# EAGLE design Butia Eagle v6 (EAGLE 5.09)
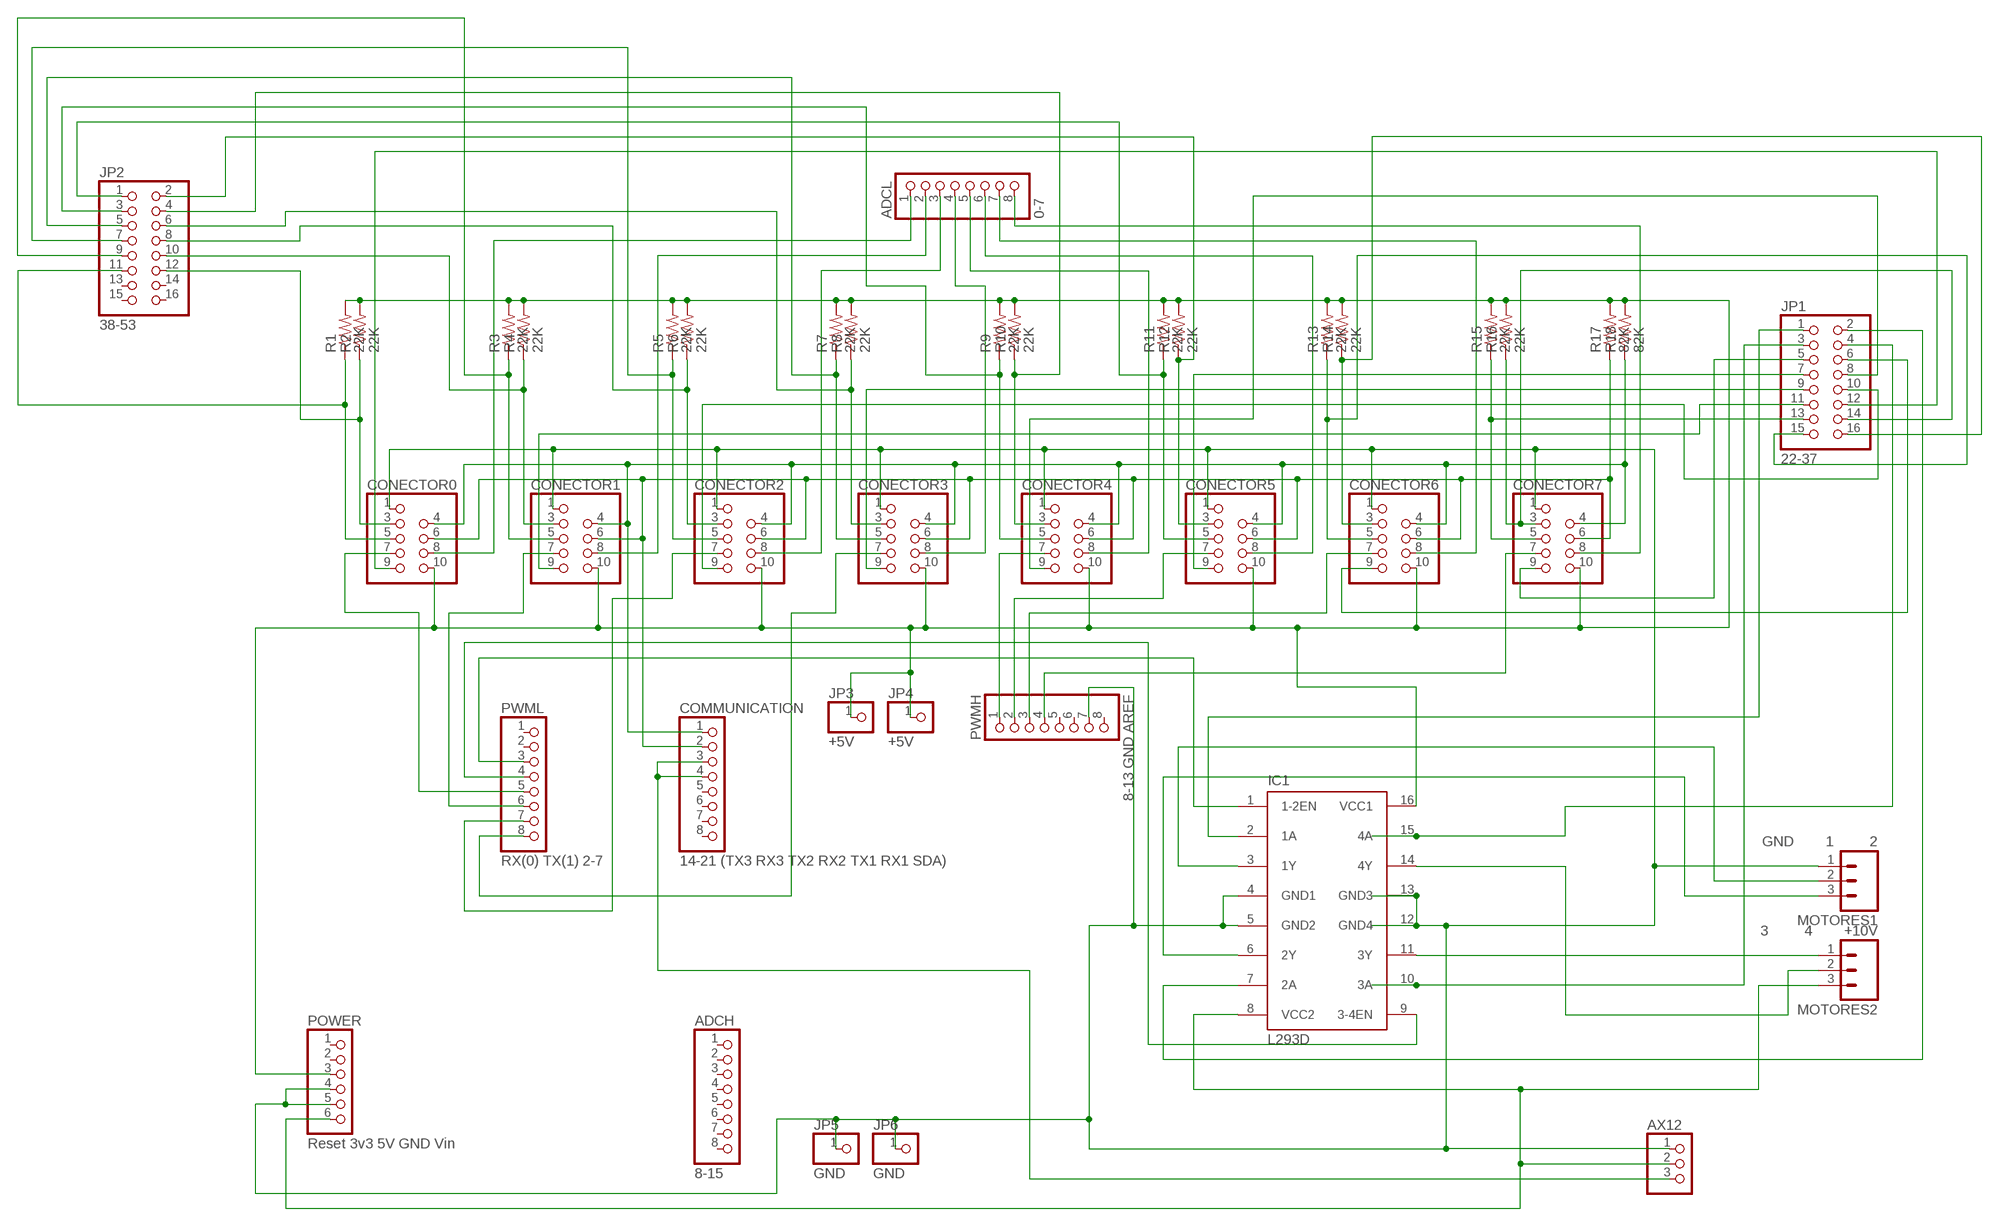
[diagram p0: schematic, sheet 1]

## Parts
ADCH  8-15  PINHD-1X8  [1X08]
ADCL  0-7  PINHD-1X8  [1X08]
AX12  AX12  [AX12]
COMMUNICATION  14-21 (TX3 RX3 TX2 RX2 TX1 RX1 SDA)  PINHD-1X8  [1X08]
CONECTOR0  9PIN  [9PIN]
CONECTOR1  9PIN  [9PIN]
CONECTOR2  9PIN  [9PIN]
CONECTOR3  9PIN  [9PIN]
CONECTOR4  9PIN  [9PIN]
CONECTOR5  9PIN  [9PIN]
CONECTOR6  9PIN  [9PIN]
CONECTOR7  9PIN  [9PIN]
IC1  L293D  [DIL16]
JP1  22-37  PINHD-2X8  [2X08]
JP2  38-53  PINHD-2X8  [2X08]
JP3  +5V  PINHD-1X1  [1X01]
JP4  +5V  PINHD-1X1  [1X01]
JP5  GND  PINHD-1X1  [1X01]
JP6  GND  PINHD-1X1  [1X01]
MOTORES1  GND 1 2  M03SCREW_LOCK  [SCREWTERMINAL-3.5MM-3_LOCK.007S]
MOTORES2  3 4 +10V  M03SCREW_LOCK  [SCREWTERMINAL-3.5MM-3_LOCK.007S]
POWER  Reset 3v3 5V GND Vin  PINHD-1X6  [1X06]
PWMH  8-13 GND AREF  PINHD-1X8  [1X08]
PWML  RX(0) TX(1) 2-7  PINHD-1X8  [1X08]
R1  22K  R-US_0207/7  [0207/7]
R2  22K  R-US_0207/7  [0207/7]
R3  22K  R-US_0207/7  [0207/7]
R4  22K  R-US_0207/7  [0207/7]
R5  22K  R-US_0207/7  [0207/7]
R6  22K  R-US_0207/7  [0207/7]
R7  22K  R-US_0207/7  [0207/7]
R8  22K  R-US_0207/7  [0207/7]
R9  22K  R-US_0207/7  [0207/7]
R10  22K  R-US_0207/7  [0207/7]
R11  22K  R-US_0207/7  [0207/7]
R12  22K  R-US_0207/7  [0207/7]
R13  22K  R-US_0207/7  [0207/7]
R14  22K  R-US_0207/7  [0207/7]
R15  22K  R-US_0207/7  [0207/7]
R16  22K  R-US_0207/7  [0207/7]
R17  82K  R-US_0207/7  [0207/7]
R18  82K  R-US_0207/7  [0207/7]

## Nets
+10V [power]: AX12.2 IC1.8(VCC2) MOTORES2.3 POWER.6
MASA [gnd]: AX12.1 CONECTOR0.1 CONECTOR1.1 CONECTOR2.1 CONECTOR3.1 CONECTOR4.1 CONECTOR5.1 CONECTOR6.1 CONECTOR7.1 IC1.4(GND1) IC1.5(GND2) IC1.12(GND4) IC1.13(GND3) JP5.1 JP6.1 MOTORES1.1 POWER.4 POWER.5 PWMH.7
N$1: CONECTOR0.5 JP2.11 R1.1
N$2: CONECTOR0.3 JP2.12 R2.1
N$3: CONECTOR1.5 JP2.9 R3.1
N$4: CONECTOR1.3 JP2.10 R4.1
N$5: CONECTOR2.5 JP2.7 R5.1
N$6: CONECTOR2.3 JP2.8 R6.1
N$8: CONECTOR3.5 JP2.5 R7.1
N$9: CONECTOR3.3 JP2.6 R8.1
N$10: CONECTOR4.3 JP2.4 R10.1
N$11: CONECTOR4.5 JP2.3 R9.1
N$13: CONECTOR5.3 JP2.2 R12.1
N$15: CONECTOR6.3 JP1.16 R14.1
N$16: CONECTOR7.5 JP1.13 R15.1
N$17: CONECTOR7.3 JP1.14 R16.1
N$18: ADCL.1 CONECTOR0.8
N$19 [polenta]: IC1.14(4Y) MOTORES2.2
N$20 [polenta]: IC1.11(3Y) MOTORES2.1
N$21 [polenta]: IC1.6(2Y) MOTORES1.3
N$22 [polenta]: IC1.3(1Y) MOTORES1.2
N$23: ADCL.2 CONECTOR1.8
N$24: ADCL.3 CONECTOR2.8
N$25: ADCL.4 CONECTOR3.8
N$26: ADCL.5 CONECTOR4.8
N$27: ADCL.6 CONECTOR5.8
N$28: ADCL.7 CONECTOR6.8
N$29: ADCL.8 CONECTOR7.8
N$30: AX12.3 COMMUNICATION.3 COMMUNICATION.4
N$31: IC1.1(1-2EN) PWML.3
N$32: IC1.9(3-4EN) PWML.4
N$33: CONECTOR0.7 PWML.5
N$34: CONECTOR1.7 PWML.6
N$35: CONECTOR2.7 PWML.7
N$36: CONECTOR3.7 PWML.8
N$37: CONECTOR4.7 PWMH.1
N$38: CONECTOR5.7 PWMH.2
N$39: CONECTOR6.7 PWMH.3
N$40: CONECTOR7.7 PWMH.4
N$41: IC1.2(1A) JP1.1
N$42: IC1.7(2A) JP1.2
N$43: IC1.10(3A) JP1.3
N$44: IC1.15(4A) JP1.4
N$45: CONECTOR7.9 JP1.5
N$46: CONECTOR6.9 JP1.6
N$47: CONECTOR5.9 JP1.7
N$48: CONECTOR4.9 JP1.8
N$49: CONECTOR3.9 JP1.9
N$50: CONECTOR2.9 JP1.10
N$51: CONECTOR1.9 JP1.11
N$52: CONECTOR0.9 JP1.12
N$53: CONECTOR5.5 JP2.1 R11.1
N$54: CONECTOR6.5 JP1.15 R13.1
POSITIVO [power]: CONECTOR0.10 CONECTOR1.10 CONECTOR2.10 CONECTOR3.10 CONECTOR4.10 CONECTOR5.10 CONECTOR6.10 CONECTOR7.10 IC1.16(VCC1) JP3.1 JP4.1 POWER.3 R1.2 R2.2 R3.2 R4.2 R5.2 R6.2 R7.2 R8.2 R9.2 R10.2 R11.2 R12.2 R13.2 R14.2 R15.2 R16.2 R17.2 R18.2
SCL: COMMUNICATION.1 CONECTOR0.4 CONECTOR1.4 CONECTOR2.4 CONECTOR3.4 CONECTOR4.4 CONECTOR5.4 CONECTOR6.4 CONECTOR7.4 R18.1
SDA: COMMUNICATION.2 CONECTOR0.6 CONECTOR1.6 CONECTOR2.6 CONECTOR3.6 CONECTOR4.6 CONECTOR5.6 CONECTOR6.6 CONECTOR7.6 R17.1
Unconnected: ADCH.1 ADCH.2 ADCH.3 ADCH.4 ADCH.5 ADCH.6 ADCH.7 ADCH.8 COMMUNICATION.5 COMMUNICATION.6 COMMUNICATION.7 COMMUNICATION.8 JP2.13 JP2.14 JP2.15 JP2.16 POWER.1 POWER.2 PWMH.5 PWMH.6 PWMH.8 PWML.1 PWML.2

## Library data of the parts
ADCH ADCL COMMUNICATION PWMH PWML = pinhead:PINHD-1X8: PIN HEADER
AX12 = butia:AX12
CONECTOR0 CONECTOR1-CONECTOR7 = butia:9PIN
IC1 = st-microelectronics:L293D: PUSH-PULL 4 CHANNEL DRIVER
JP1 JP2 = pinhead:PINHD-2X8: PIN HEADER
JP3-JP6 = pinhead:PINHD-1X1: PIN HEADER
MOTORES1 MOTORES2 = SparkFun:M03: Header 3 Standard 3-pin 0.1" header. Use with straight break away headers (SKU : PRT-00116), right angle break away headers (PRT-00553), swiss pins (PRT-00743), machine pins (PRT-00117), and female headers (PRT-00115). Molex polarized connector foot print use with SKU : PRT-08232 with associated crimp pins and housings.
POWER = pinhead:PINHD-1X6: PIN HEADER
R1-R18 = resistor:R-US_: RESISTOR, American symbol

## Net classes
0 default: width 0.229 mm, drill 0.406 mm, clearance 0.203 mm
1 power: width 0.508 mm, drill 0.711 mm, clearance 0.203 mm
2 gnd: width 0.406 mm, drill 0.61 mm, clearance 0.203 mm
3 polenta: width 0.356 mm, drill 0.508 mm, clearance 0.203 mm

## Board
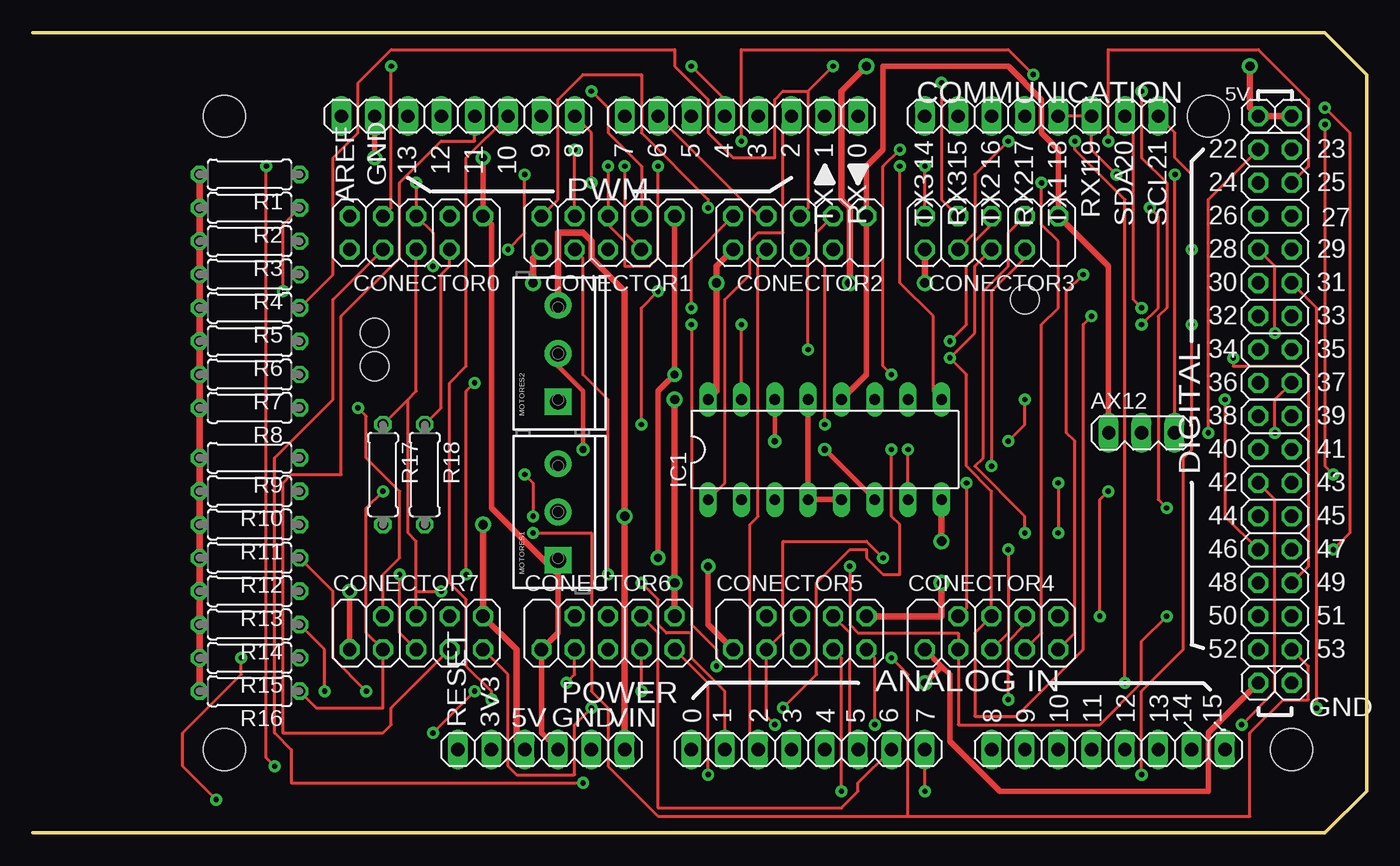
[diagram p1: board, top side]
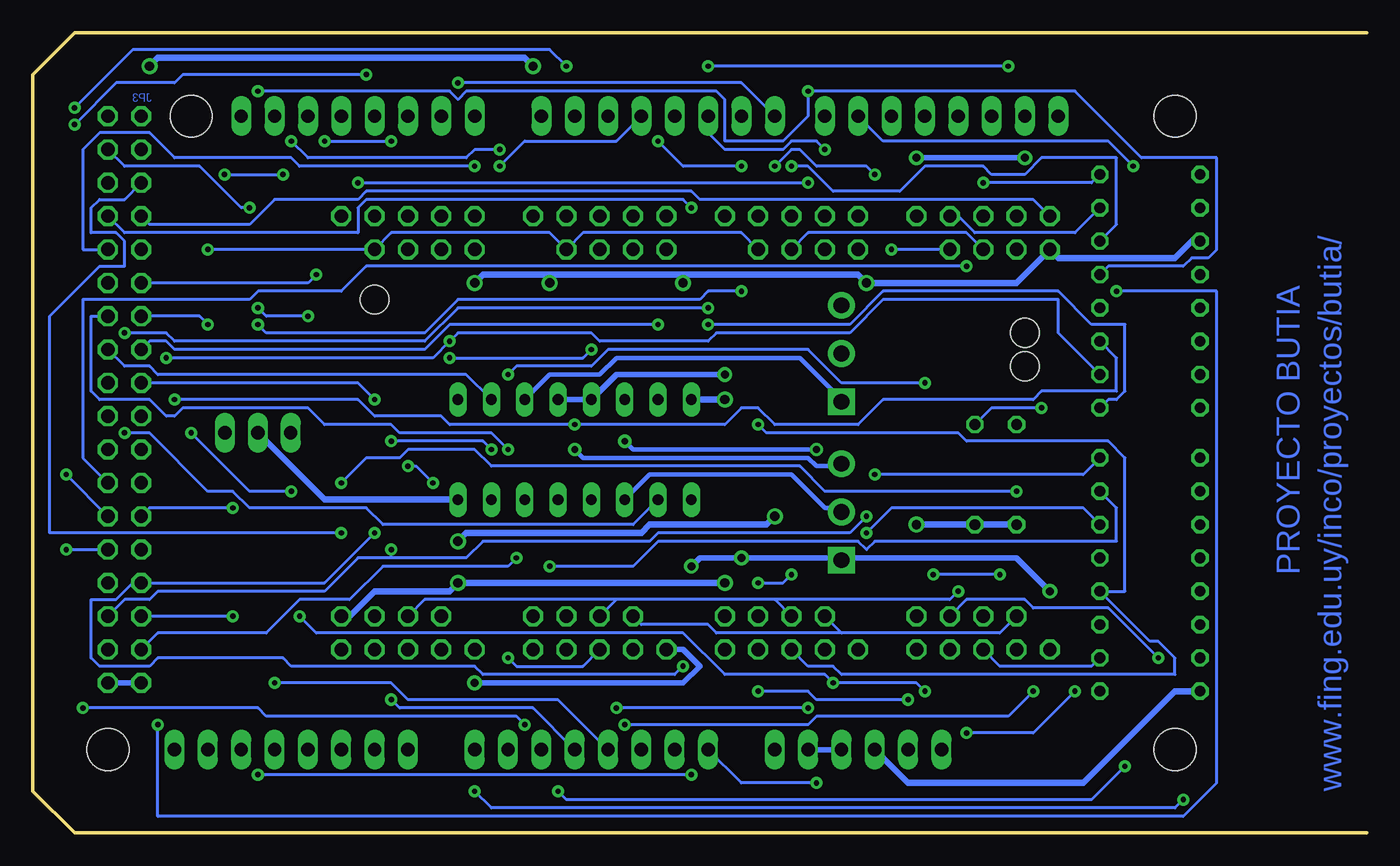
[diagram p2: board, bottom side, seen from below]

Size 101.6 x 60.96 mm. Coordinates in mm from the lower left corner, seen from the top.
Outline: 0,60.96 98.42,60.96 101.6,57.79 101.6,3.17 98.42,0 0,0
Copper layers (1*16): Top 0.035mm / dielectric 1.5mm / Bottom 0.035mm
Design rules "default *": minimum track width 8mil, minimum drill 16mil, track to track 8mil, track to pad 8mil, pad to pad 8mil, via to via 10mil, smd to smd 8mil, copper to edge 40mil, drill to drill 12mil, minimum pad ring 10mil, minimum via ring 10mil, stop-mask expansion 4mil, vias tented up to drill 0mil, thermal gap 10mil
Holes 3.2 mm at 95.88,6.35 14.61,54.61 89.53,54.61 14.61,6.35
Holes 2.2 mm at 75.56,40.64 26.04,38.1 26.04,35.56

### Footprints (pad centres in the part's own frame; a part is rotated, then mirrored left to right if it is on the bottom)
1X08 = drill 1.016 long: 1 -8.89,0; 2 -6.35,0; 3 -3.81,0; 4 -1.27,0; 5 1.27,0; 6 3.81,0; 7 6.35,0; 8 8.89,0
AX12 = drill 1.016 long: 1 -2.498,0; 2 0,0; 3 2.507,0.005
9PIN = drill 1.016 octagon: 1 -5.08,-1.27; 3 -2.54,-1.27; 4 -2.54,1.27; 5 0,-1.27; 6 0,1.27; 7 2.54,-1.27; 8 2.54,1.27; 9 5.08,-1.27; 10 5.08,1.27
DIL16 = drill 0.813 long: 1 -8.89,-3.81; 2 -6.35,-3.81; 3 -3.81,-3.81; 4 -1.27,-3.81; 5 1.27,-3.81; 6 3.81,-3.81; 7 6.35,-3.81; 8 8.89,-3.81; 9 8.89,3.81; 10 6.35,3.81; 11 3.81,3.81; 12 1.27,3.81; 13 -1.27,3.81; 14 -3.81,3.81; 15 -6.35,3.81; 16 -8.89,3.81
2X08 = drill 1.016 octagon: 1 -8.89,-1.27; 2 -8.89,1.27; 3 -6.35,-1.27; 4 -6.35,1.27; 5 -3.81,-1.27; 6 -3.81,1.27; 7 -1.27,-1.27; 8 -1.27,1.27; 9 1.27,-1.27; 10 1.27,1.27; 11 3.81,-1.27; 12 3.81,1.27; 13 6.35,-1.27; 14 6.35,1.27; 15 8.89,-1.27; 16 8.89,1.27
1X01 = drill 1.016 octagon: 1 0,0
SCREWTERMINAL-3.5MM-3_LOCK.007S = drill 1.2 pad 2.032 square: 1 -0.178,0 | drill 1.2 pad 2.032 round: 2 3.5,0; 3 7.178,0
1X06 = drill 1.016 long: 1 -6.35,0; 2 -3.81,0; 3 -1.27,0; 4 1.27,0; 5 3.81,0; 6 6.35,0
0207/7 = drill 0.813 octagon: 1 -3.81,0; 2 3.81,0

### Placement (x,y rotation side)
ADCH  81.91,6.35 0 top
ADCL  59.05,6.35 0 top
AX12  84.45,30.48 0 top
COMMUNICATION  76.83,54.61 180 top
CONECTOR0  29.21,45.72 180 top
CONECTOR1  43.82,45.72 180 top
CONECTOR2  58.42,45.72 180 top
CONECTOR3  73.02,45.72 180 top
CONECTOR4  73.02,15.24 0 top
CONECTOR5  58.42,15.24 0 top
CONECTOR6  43.82,15.24 0 top
CONECTOR7  29.21,15.24 0 top
IC1  60.33,29.21 0 top
JP1  94.61,43.18 90 top
JP2  94.61,22.86 90 top
JP3  93.34,54.61 0 top
JP4  95.88,54.61 0 top
JP5  93.34,11.43 0 top
JP6  95.88,11.43 0 top
MOTORES1  40.01,20.95 90 top
MOTORES2  40.01,33.02 90 top
POWER  38.73,6.35 0 top
PWMH  32.39,54.61 180 top
PWML  53.98,54.61 180 top
R1  16.51,50.16 180 top
R2  16.51,47.62 180 top
R3  16.51,45.09 180 top
R4  16.51,42.55 180 top
R5  16.51,40.01 180 top
R6  16.51,37.47 180 top
R7  16.51,34.92 180 top
R8  16.51,32.38 180 top
R9  16.51,28.57 180 top
R10  16.51,26.04 180 top
R11  16.51,23.49 180 top
R12  16.51,20.95 180 top
R13  16.51,18.41 180 top
R14  16.51,15.88 180 top
R15  16.51,13.34 180 top
R16  16.51,10.79 180 top
R17  26.67,27.3 270 top
R18  29.84,27.3 270 top

### Tracks (layer width: path | path; a pad name or v marks a point on that pad's centre or on a via)
+10V  (via drill 0.71)
  Top 0.508: POWER.6 v45.09,24.13 45.09,41.28 42.55,43.82 42.55,45.09 41.91,45.72 40.01,45.72 MOTORES2.3 | v69.21,22.22 IC1.8
  Bottom 0.508: IC1.8 79.38,25.4 AX12.2 | v69.21,22.22 68.58,22.86 55.25,22.86 54.61,23.49 45.72,23.49 v45.09,24.13
MASA  (via drill 0.61)
  Top 0.406: AX12.1 81.91,30.48 81.91,43.18 CONECTOR3.1 78.1,52.07 76.83,53.34 76.83,55.88 74.3,58.42 64.77,58.42 64.77,52.07 63.5,50.8 CONECTOR2.1 63.5,34.92 IC1.12 | IC1.5 IC1.4 IC1.13 | CONECTOR1.1 v48.9,34.92 47.62,33.66 v47.62,20.95 | 69.21,12.7 69.85,12.07 69.85,6.98 73.66,3.17 89.53,3.17 89.53,7.62 JP5.1 | 69.21,12.7 CONECTOR4.1 | CONECTOR7.1 v24.13,18.41 | 40.01,19.68 40.01,15.24 CONECTOR6.1 38.73,7.62 POWER.4 | MOTORES1.1 40.01,19.68 | 40.01,19.68 34.93,24.76 34.93,46.36 CONECTOR0.1 v34.29,51.44 | v26.04,51.44 PWMH.7 | CONECTOR5.1 51.44,15.88 v51.44,20.32 | v67.94,11.43 69.21,12.7
  Bottom 0.406: IC1.12 IC1.13 57.15,34.92 v48.9,34.92 | JP5.1 JP6.1 | POWER.4 POWER.5 | v24.13,18.41 26.67,20.95 40.01,20.95 | v34.29,51.44 v26.04,51.44 | v51.44,20.32 50.8,20.95 v47.62,20.95 40.01,20.95 | 40.01,20.95 MOTORES1.1 | v67.94,11.43 52.07,11.43 50.8,12.7 52.07,13.97 CONECTOR5.1
N$1  (via drill 0.41)
  Top 0.229: v29.21,49.53 CONECTOR0.5 30.48,45.72 v30.48,43.18
  Bottom 0.229: R1.1 20.95,49.53 v29.21,49.53 | JP2.11 97.79,28.57 97.79,40.64 85.09,40.64 84.45,41.28 78.1,41.28 76.2,43.18 v30.48,43.18
N$2  (via drill 0.41)
  Top 0.229: JP2.12 94.61,25.4 94.61,10.79 v92.07,8.26 | v19.05,41.28 19.05,46.36 R2.1
  Bottom 0.229: R2.1 22.22,45.72 29.84,45.72 31.11,46.99 CONECTOR0.3 | v92.07,8.26 92.07,1.27 13.97,1.27 11.43,3.81 11.43,41.28 v19.05,41.28
N$3  (via drill 0.41)
  Top 0.229: v43.82,50.8 CONECTOR1.5 43.82,46.36 45.09,45.09 45.09,43.18 46.99,43.18 47.62,43.82 v47.62,50.8 | v99.06,27.3 98.42,27.94 v98.42,53.98 | v76.2,57.79 74.3,59.69 53.98,59.69 v53.98,52.71
  Bottom 0.229: R3.1 19.05,46.36 19.05,51.44 24.76,51.44 26.04,50.16 28.57,50.16 29.21,50.8 33.66,50.8 35.56,48.9 40.64,48.9 42.55,50.8 v43.82,50.8 | v99.06,27.3 JP2.9 | v98.42,53.98 95.25,57.15 90.8,57.15 90.17,57.79 v76.2,57.79 | v53.98,52.71 52.07,50.8 v47.62,50.8
N$4  (via drill 0.41)
  Top 0.229: v42.55,56.52 43.82,55.25 43.82,53.34 46.36,50.8 CONECTOR1.3 | v86.36,24.76 85.72,25.4 85.72,39.37 86.36,40.01 86.36,49.53 84.45,51.44 v84.45,56.52
  Bottom 0.229: R4.1 19.68,43.18 13.97,43.18 13.34,43.82 12.06,43.82 11.43,44.45 11.43,51.44 17.14,51.44 22.22,56.52 v42.55,56.52 42.55,54.61 44.45,52.71 48.9,52.71 48.9,55.88 49.53,56.52 68.58,56.52 69.21,55.88 69.85,56.52 v84.45,56.52 | JP2.10 92.71,24.76 v86.36,24.76
N$5  (via drill 0.41)
  Top 0.229: R5.1 22.86,42.55 22.86,51.44 24.76,53.34 24.76,57.15 27.3,59.69 48.9,59.69 48.9,58.42 51.44,55.88 51.44,53.34 53.34,51.44 56.52,51.44 56.52,55.88 57.15,56.52 59.05,56.52 | 59.05,56.52 59.05,47.62 CONECTOR2.5 | v99.06,21.59 100.33,22.86 100.33,53.34 v98.42,55.25 | 59.05,56.52 v60.96,58.42
  Bottom 0.229: v99.06,21.59 JP2.7 | v98.42,55.25 93.98,59.69 62.23,59.69 v60.96,58.42
N$6  (via drill 0.41)
  Top 0.229: v60.33,31.11 60.33,43.18 59.69,43.82 59.69,45.72 CONECTOR2.3 | JP2.8 90.8,24.13 v90.8,33.02
  Bottom 0.229: R6.1 19.05,36.2 19.05,33.66 24.76,33.66 25.4,33.02 36.83,33.02 38.73,31.11 45.09,31.11 46.36,32.38 47.62,32.38 48.9,31.11 v60.33,31.11 69.85,31.11 70.48,31.75 75.56,31.75 76.83,33.02 v90.8,33.02
N$8  (via drill 0.41)
  Top 0.229: v69.85,37.47 71.12,38.73 71.12,43.18 71.75,43.82 71.75,45.09 73.02,46.36 CONECTOR3.5 | JP2.5 97.16,20.32 97.16,34.92 96.52,35.56 91.44,35.56 v91.44,36.2
  Bottom 0.229: R7.1 23.49,38.1 23.49,40.64 36.83,40.64 39.37,38.1 49.53,38.1 50.16,37.47 58.42,37.47 59.05,38.1 69.21,38.1 v69.85,37.47 71.12,36.2 v91.44,36.2
N$9  (via drill 0.41)
  Top 0.229: v50.16,38.73 50.16,15.88 52.07,13.97 v52.07,12.7 | CONECTOR3.3 74.3,45.72 74.3,43.18 72.39,41.28 72.39,28.57 71.75,27.94 75.56,24.13 v75.56,22.86
  Bottom 0.229: R8.1 19.68,33.02 19.05,33.02 18.41,33.66 18.41,38.73 20.95,38.73 23.49,41.28 36.83,41.28 39.37,38.73 v50.16,38.73 | v52.07,12.7 52.71,12.07 67.31,12.07 67.94,12.7 81.91,12.7 82.55,13.34 92.07,13.34 92.71,12.7 96.52,12.7 97.16,13.34 97.16,17.78 95.25,17.78 93.98,19.05 JP2.6 79.38,19.05 v75.56,22.86
N$10  (via drill 0.41)
  Top 0.229: v62.23,20.32 62.23,15.88 62.87,15.24 70.48,15.24 CONECTOR4.3 70.48,8.26 81.28,8.26 84.45,11.43 84.45,14.61 v86.36,16.51
  Bottom 0.229: R10.1 19.05,24.76 19.05,22.22 37.47,22.22 38.1,21.59 38.73,22.22 53.98,22.22 55.88,20.32 v62.23,20.32 | v86.36,16.51 JP2.4
N$11  (via drill 0.41)
  Top 0.229: v37.47,27.3 38.1,26.67 v38.1,24.13 | CONECTOR4.5 74.3,15.24 v74.3,21.59
  Bottom 0.229: R9.1 21.59,27.3 v37.47,27.3 | v38.1,24.13 39.37,22.86 53.98,22.86 54.61,22.22 67.31,22.22 68.58,20.95 74.3,20.95 | 74.3,20.95 76.83,20.95 79.38,18.41 92.07,18.41 92.71,17.78 94.61,17.78 JP2.3 | 74.3,20.95 v74.3,21.59
N$13  (via drill 0.41)
  Top 0.229: R12.1 22.86,18.41 22.86,13.34 v25.4,10.79 | v56.52,8.26 55.88,8.89 CONECTOR5.3 57.15,15.24 57.15,22.22 63.5,22.22 v64.77,20.95
  Bottom 0.229: v25.4,10.79 27.3,8.89 41.91,8.89 42.55,8.26 v56.52,8.26 | JP2.2 92.07,15.24 83.82,15.24 81.28,17.78 77.47,17.78 74.93,20.32 65.41,20.32 v64.77,20.95
N$15  (via drill 0.41)
  Top 0.229: R14.1 22.22,13.97 v22.22,10.79 | v30.48,7.62 v33.66,10.79 | v40.64,11.43 41.27,12.07 CONECTOR6.3 | JP1.16 89.53,48.26 v89.53,30.48 | v81.91,26.04 81.28,25.4 v81.28,16.51
  Bottom 0.229: v22.22,10.79 25.4,7.62 v30.48,7.62 | v33.66,10.79 34.29,11.43 v40.64,11.43 41.27,12.07 48.9,12.07 52.07,15.24 80.01,15.24 v81.28,16.51 | v89.53,30.48 85.09,26.04 v81.91,26.04
N$16  (via drill 0.41)
  Top 0.229: JP1.13 97.16,50.8 97.16,55.88 93.34,59.69 81.91,59.69 v81.91,52.71 | v66.04,52.07 64.77,50.8 64.77,35.56 v65.41,34.92 | v33.66,34.29 33.02,33.66 v33.02,19.68 | v27.94,19.68 27.94,15.24 CONECTOR7.5
  Bottom 0.229: R15.1 20.95,12.7 27.94,12.7 CONECTOR7.5 | v81.91,52.71 80.64,51.44 68.58,51.44 67.94,52.07 v66.04,52.07 | v65.41,34.92 64.77,35.56 59.05,35.56 57.79,36.83 42.55,36.83 40.01,34.29 v33.66,34.29 | v27.94,19.68 v33.02,19.68
N$17  (via drill 0.41)
  Top 0.229: R16.1 21.59,9.53 26.67,9.53 CONECTOR7.3 25.4,15.24 25.4,24.76 v26.67,26.04 | v78.1,26.67 v78.1,22.86
  Bottom 0.229: JP1.14 94.61,48.26 96.52,48.26 97.16,47.62 97.16,45.72 95.25,45.72 94.61,45.09 94.61,43.18 96.52,43.18 100.33,39.37 100.33,22.86 v78.1,22.86 | v78.1,26.67 76.2,28.57 73.66,28.57 73.02,29.21 67.94,29.21 66.67,27.94 43.18,27.94 41.27,26.04 v26.67,26.04
N$18  (via drill 0.41)
  Top 0.229: v41.91,3.81 19.68,3.81 19.68,6.35 18.41,7.62 18.41,28.57 22.86,33.02 22.86,40.64 CONECTOR0.8
  Bottom 0.229: ADCL.1 47.62,3.81 v41.91,3.81
N$19  (via drill 0.51)
  Top 0.356: v56.52,29.84 IC1.14 | v41.91,29.21 41.91,33.66 40.01,35.56 MOTORES2.2
  Bottom 0.356: v56.52,29.84 55.88,29.21 v41.91,29.21
N$20
  Bottom 0.356: IC1.11 62.23,34.92 58.42,34.92 57.15,36.2 43.18,36.2 40.01,33.02 MOTORES2.1
N$21  (via drill 0.51)
  Top 0.356: v60.33,29.21 IC1.6
  Bottom 0.356: v60.33,29.21 59.69,28.57 42.55,28.57 41.91,27.94 40.01,27.94 MOTORES1.3
N$22
  Bottom 0.356: IC1.3 54.61,27.3 43.82,27.3 41.27,24.76 40.01,24.76 MOTORES1.2
N$23  (via drill 0.41)
  Top 0.229: CONECTOR1.8 41.91,43.82 41.91,34.92 43.82,33.02 v43.82,19.68 | v46.36,19.05 47.62,17.78 47.62,15.88 48.26,15.24 50.16,15.24 50.16,13.34 52.71,10.79 ADCL.2
  Bottom 0.229: v43.82,19.68 44.45,19.05 v46.36,19.05
N$24
  Top 0.229: ADCL.3 54.61,6.98 54.61,23.49 55.25,24.13 55.25,43.82 CONECTOR2.8
N$25  (via drill 0.41)
  Top 0.229: v83.18,11.43 83.18,48.26 79.38,52.07 v79.38,52.71 | v74.3,52.71 71.75,50.16 71.75,45.72 CONECTOR3.8
  Bottom 0.229: ADCL.4 61.59,10.16 73.02,10.16 74.3,11.43 v83.18,11.43 | v79.38,52.71 v74.3,52.71
N$26  (via drill 0.41)
  Top 0.229: v74.3,10.16 74.3,14.61 75.56,15.88 CONECTOR4.8
  Bottom 0.229: ADCL.5 63.5,9.53 73.66,9.53 v74.3,10.16
N$27
  Top 0.229: CONECTOR5.8 62.23,15.24 62.23,6.98 ADCL.6
N$28
  Top 0.229: ADCL.7 62.87,3.81 62.87,3.17 61.59,1.91 47.62,1.91 47.62,15.24 CONECTOR6.8
N$29  (via drill 0.41)
  Top 0.229: v67.94,3.17 ADCL.8 | v13.97,2.54 11.43,5.08 11.43,7.62 15.88,12.07 v15.88,13.34
  Bottom 0.229: v67.94,3.17 66.67,1.91 14.61,1.91 v13.97,2.54 | v15.88,13.34 19.68,17.14 25.4,17.14 26.04,17.78 30.48,17.78 CONECTOR7.8
N$30  (via drill 0.41)
  Top 0.229: COMMUNICATION.4 COMMUNICATION.3 80.64,52.07 v82.55,50.16 | v86.99,50.16 86.99,31.11 AX12.3
  Bottom 0.229: v86.99,50.16 v82.55,50.16
N$31
  Top 0.229: IC1.1 52.71,26.67 52.71,40.64 54.61,42.55 54.61,45.09 55.25,45.72 57.15,45.72 57.15,53.98 PWML.3
N$32  (via drill 0.41)
  Top 0.229: IC1.9 68.58,33.66 68.58,39.37 66.04,41.91 v66.04,50.8
  Bottom 0.229: v66.04,50.8 64.13,52.71 57.15,52.71 PWML.4
N$33  (via drill 0.41)
  Top 0.229: CONECTOR0.7 27.3,47.62 v27.3,58.42 | v50.16,58.42 52.71,55.88 PWML.5
  Bottom 0.229: v27.3,58.42 v50.16,58.42
N$34  (via drill 0.41)
  Top 0.229: CONECTOR1.7 v41.27,52.07
  Bottom 0.229: v41.27,52.07 41.91,52.71 43.82,52.71 44.45,52.07 48.9,52.07 50.16,53.34 PWML.6
N$35
  Top 0.229: PWML.7 55.25,46.99 CONECTOR2.7
N$36  (via drill 0.41)
  Top 0.229: CONECTOR3.7 69.21,48.26 v69.21,57.15
  Bottom 0.229: v69.21,57.15 47.62,57.15 PWML.8
N$37  (via drill 0.41)
  Top 0.229: CONECTOR4.7 76.83,15.24 76.83,38.73 78.1,40.01 78.1,45.09 76.83,46.36 v76.83,49.53 | v42.55,49.53 42.55,53.34 PWMH.1
  Bottom 0.229: v76.83,49.53 v42.55,49.53
N$38  (via drill 0.41)
  Top 0.229: CONECTOR5.7 61.59,13.34 v61.59,3.17 | v18.41,5.08 17.78,5.71 v17.78,50.8
  Bottom 0.229: v61.59,3.17 60.96,2.54 20.95,2.54 v18.41,5.08 | v17.78,50.8 19.68,52.71 36.83,52.71 PWMH.2
N$39  (via drill 0.41)
  Top 0.229: PWMH.3 33.02,51.44 33.02,35.56 31.75,34.29 31.75,19.05 33.02,17.78 33.02,12.7 34.93,10.79 v34.93,10.16 | v46.36,10.79 CONECTOR6.7
  Bottom 0.229: v34.93,10.16 41.91,10.16 42.55,10.79 v46.36,10.79
N$40
  Top 0.229: CONECTOR7.7 27.3,9.53 27.3,8.26 26.67,7.62 19.05,7.62 19.05,26.67 19.68,27.3 23.49,27.3 23.49,39.37 27.94,43.82 27.94,49.53 31.11,52.71 33.66,52.71 PWMH.4
N$41  (via drill 0.41)
  Top 0.229: v94.61,30.48 94.61,33.02 JP1.1
  Bottom 0.229: IC1.2 55.88,23.49 74.93,23.49 76.2,24.76 85.09,24.76 86.36,26.04 88.27,26.04 92.71,30.48 v94.61,30.48
N$42  (via drill 0.41)
  Top 0.229: IC1.7 v66.67,29.21 | v74.3,29.84 75.56,31.11 v75.56,33.02
  Bottom 0.229: v66.67,29.21 67.31,29.84 v74.3,29.84 | v75.56,33.02 76.83,34.29 JP1.2
N$43
  Bottom 0.229: IC1.10 68.58,34.92 92.07,34.92 92.71,35.56 94.61,35.56 JP1.3
N$44  (via drill 0.41)
  Top 0.229: IC1.15 v53.98,38.73
  Bottom 0.229: v53.98,38.73 69.85,38.73 71.75,36.83 90.8,36.83 91.44,37.47 92.71,37.47 JP1.4
N$45  (via drill 0.41)
  Top 0.229: CONECTOR7.9 36.2,12.07 36.2,5.08 36.83,4.45 41.27,4.45 41.27,8.26 v42.55,9.53 | v57.15,9.53 59.69,12.07 59.69,19.05 62.23,21.59 63.5,21.59 63.5,20.95 64.77,19.68 66.04,19.68 66.04,23.49 65.41,24.13 v65.41,29.21
  Bottom 0.229: v42.55,9.53 v57.15,9.53 | v65.41,29.21 66.67,30.48 73.66,30.48 74.3,31.11 79.38,31.11 80.64,32.38 90.17,32.38 90.8,31.75 91.44,31.75 92.71,33.02 96.52,33.02 97.16,33.66 97.16,39.37 JP1.5
N$46  (via drill 0.41)
  Top 0.229: CONECTOR6.9 51.44,11.43 v51.44,4.45 | v84.45,4.45 84.45,10.79 87.63,13.97 87.63,28.57 88.27,29.21 v88.27,38.73
  Bottom 0.229: v51.44,4.45 v84.45,4.45 | v88.27,38.73 88.9,39.37 JP1.6
N$47  (via drill 0.41)
  Top 0.229: CONECTOR5.9 64.13,13.34 v64.13,8.26 | v97.79,9.53 97.79,40.01 JP1.7
  Bottom 0.229: v64.13,8.26 64.77,8.89 83.82,8.89 84.45,9.53 v97.79,9.53
N$48  (via drill 0.41)
  Top 0.229: CONECTOR4.9 79.38,15.24 79.38,29.84 78.74,30.48 78.74,41.28 v80.01,42.55
  Bottom 0.229: v80.01,42.55 80.64,41.91 JP1.8
N$49  (via drill 0.41)
  Top 0.229: CONECTOR3.9 v67.94,50.8
  Bottom 0.229: v67.94,50.8 81.28,50.8 81.91,51.44 90.8,51.44 92.71,53.34 96.52,53.34 97.79,52.07 97.79,44.45 JP1.9
N$50  (via drill 0.41)
  Top 0.229: CONECTOR2.9 50.16,43.82 v50.16,40.01 | v94.61,38.1 94.61,43.18 JP1.10
  Bottom 0.229: v50.16,40.01 69.21,40.01 71.75,37.47 90.8,37.47 91.44,38.1 v94.61,38.1
N$51  (via drill 0.41)
  Top 0.229: CONECTOR1.9 40.01,48.26 40.01,55.88 41.91,57.79 46.36,57.79 46.36,53.34 51.44,48.26 v51.44,47.62
  Bottom 0.229: v51.44,47.62 52.07,48.26 76.2,48.26 76.83,47.62 76.83,45.72 94.61,45.72 JP1.11
N$52
  Bottom 0.229: CONECTOR0.9 25.4,48.26 50.8,48.26 51.44,48.9 76.2,48.9 76.83,48.26 83.18,48.26 85.09,46.36 92.71,46.36 JP1.12
N$53  (via drill 0.41)
  Top 0.229: v38.1,22.86 42.55,22.86 42.55,10.79 43.82,9.53 43.82,5.08 47.62,1.27 66.67,1.27 | 66.67,1.27 92.71,1.27 92.71,7.62 95.25,10.16 97.16,10.16 97.16,12.7 JP2.1 | v65.41,13.34 66.67,12.07 66.67,1.27
  Bottom 0.229: R11.1 21.59,24.76 36.2,24.76 v38.1,22.86 | CONECTOR5.5 59.69,12.7 64.77,12.7 v65.41,13.34
N$54  (via drill 0.41)
  Top 0.229: v85.09,47.62 85.72,46.99 85.72,40.01 v84.45,38.73 | v47.62,41.28 46.36,40.01 v46.36,31.11
  Bottom 0.229: CONECTOR6.5 42.55,12.7 40.64,12.7 40.01,12.07 14.61,12.07 14.61,13.34 15.88,14.61 16.51,14.61 R13.1 18.41,18.41 18.41,28.57 19.68,29.84 30.48,29.84 31.11,30.48 45.72,30.48 v46.36,31.11 | JP1.15 94.61,50.8 88.9,50.8 85.72,47.62 v85.09,47.62 | v84.45,38.73 83.82,38.1 71.75,38.1 69.21,40.64 50.8,40.64 50.16,41.28 v47.62,41.28
POSITIVO  (via drill 0.71)
  Top 0.508: CONECTOR5.10 69.21,16.51 v69.21,19.05 | IC1.16 52.07,33.66 v52.07,41.91 52.07,43.18 CONECTOR2.10 | v48.9,33.02 v48.9,19.05 CONECTOR6.10 | POWER.3 36.83,6.98 36.83,13.97 CONECTOR7.10 v34.29,23.49 | R16.2 R15.2 R14.2 R13.2 R12.2 R11.2 R10.2 R9.2 R8.2 R7.2 R6.2 R5.2 R4.2 R3.2 R2.2 R1.2 | JP4.1 JP3.1 92.71,55.25 v92.71,58.42 | CONECTOR1.10 38.1,43.82 v38.1,41.91 | v67.94,41.91 CONECTOR3.10 | v63.5,58.42 61.59,56.52 61.59,48.26 62.23,47.62 v62.23,41.91
  Bottom 0.508: CONECTOR4.10 77.47,16.51 75.56,18.41 69.85,18.41 v69.21,19.05 v48.9,19.05 | IC1.16 v48.9,33.02 | R17.2 R18.2 v34.29,23.49 | R3.2 13.34,45.09 14.61,43.82 23.49,43.82 CONECTOR0.10 26.67,41.91 v38.1,41.91 38.73,42.55 52.07,42.55 | v67.94,41.91 67.31,42.55 62.23,42.55 | 52.07,42.55 62.23,42.55 | v92.71,58.42 92.07,59.05 64.13,59.05 v63.5,58.42 | 62.23,42.55 v62.23,41.91 | POWER.3 34.93,3.81 21.59,3.81 14.61,10.79 R16.2 | 52.07,42.55 v52.07,41.91
SCL  (via drill 0.41)
  Top 0.229: R18.1 31.11,32.38 31.11,42.55 31.75,43.18 CONECTOR0.4 | v24.76,32.38 25.4,31.75 25.4,28.57 27.94,26.04 27.94,20.95 26.67,19.68 CONECTOR7.4 | CONECTOR4.4 71.12,17.14 v71.12,26.67 | v73.02,27.94 73.02,41.28 75.56,43.82 CONECTOR3.4 | COMMUNICATION.1 86.99,53.34 86.99,51.44 88.27,50.16 v88.27,44.45 | v36.2,44.45 37.47,45.72 v37.47,50.16 | v45.09,50.8 45.09,45.72 CONECTOR1.4
  Bottom 0.229: CONECTOR7.4 27.94,15.24 40.01,15.24 | 40.01,15.24 CONECTOR6.4 | CONECTOR5.4 55.25,15.88 50.16,15.88 49.53,15.24 40.01,15.24 | R18.1 28.57,32.38 v24.76,32.38 | CONECTOR1.4 47.62,45.72 59.69,45.72 CONECTOR2.4 62.23,45.72 74.3,45.72 CONECTOR3.4 v88.27,44.45 | v71.12,26.67 72.39,27.94 v73.02,27.94 | CONECTOR0.4 v36.2,44.45 | v37.47,50.16 38.1,50.8 41.91,50.8 43.18,52.07 43.82,52.07 v45.09,50.8
SDA  (via drill 0.41)
  Top 0.229: 28.57,33.02 29.21,33.66 CONECTOR0.6 | 28.57,33.02 R17.1 | 29.21,18.41 29.21,22.22 28.57,22.86 28.57,33.02 | CONECTOR7.6 29.21,18.41 | CONECTOR2.6 59.05,43.82 v59.05,36.83 | CONECTOR3.6 71.75,43.18 71.75,38.1 v69.85,36.2 71.12,34.92 71.12,27.94 73.02,26.04 CONECTOR4.6 71.75,15.24 71.75,8.89 74.93,8.89 80.01,13.97 80.01,38.73 v80.64,39.37 | COMMUNICATION.2 83.82,53.98 83.82,40.64 v84.45,40.01 | 29.21,18.41 v31.11,18.41
  Bottom 0.229: CONECTOR1.6 42.55,45.72 30.48,45.72 CONECTOR0.6 | v59.05,36.83 59.69,36.2 v69.85,36.2 | 45.09,17.78 CONECTOR6.6 | 45.09,17.78 57.15,17.78 | 57.15,17.78 CONECTOR5.6 | CONECTOR4.6 71.75,17.78 57.15,17.78 | v84.45,40.01 83.82,39.37 v80.64,39.37 | v31.11,18.41 31.75,17.78 45.09,17.78

### Text on the board
Bottom: PROYECTO BUTIA | www.fing.edu.uy/inco/proyectos/butia/
tPlace: 9 | 8 | 7 | 6 | 5 | 4 | 3 | 2 | 1 | 0 | 22 | 23 | 14 | 15 | 16 | 17 | 18 | 19 | 20 | 21 | 13 | 12 | 11 | 10 | 24 | 25 | 27 | 26 | 28 | 29 | 30 | 31 | 32 | 33 | 34 | 35 | 36 | 37 | 38 | 39 | 40 | 41 | 42 | 43 | 44 | 45 | 46 | 47 | 48 | 49 | 50 | 51 | 52 | 53 | 0 | 1 | 2 | 3 | 4 | 5 | 6 | 7 | 8 | 9 | 10 | 11 | 12 | 13 | 14 | 15
tNames: 5V | GND | AREF | PWM | TX | RX | RX1 | TX3 | RX3 | TX2 | RX2 | TX1 | SDA | SCL | DIGITAL | ANALOG IN | GND | RESET | 3V3 | 5V | GND | VIN